# Altium schematic sheet CAN&IR.SchDoc
size A4; Revision: B.2
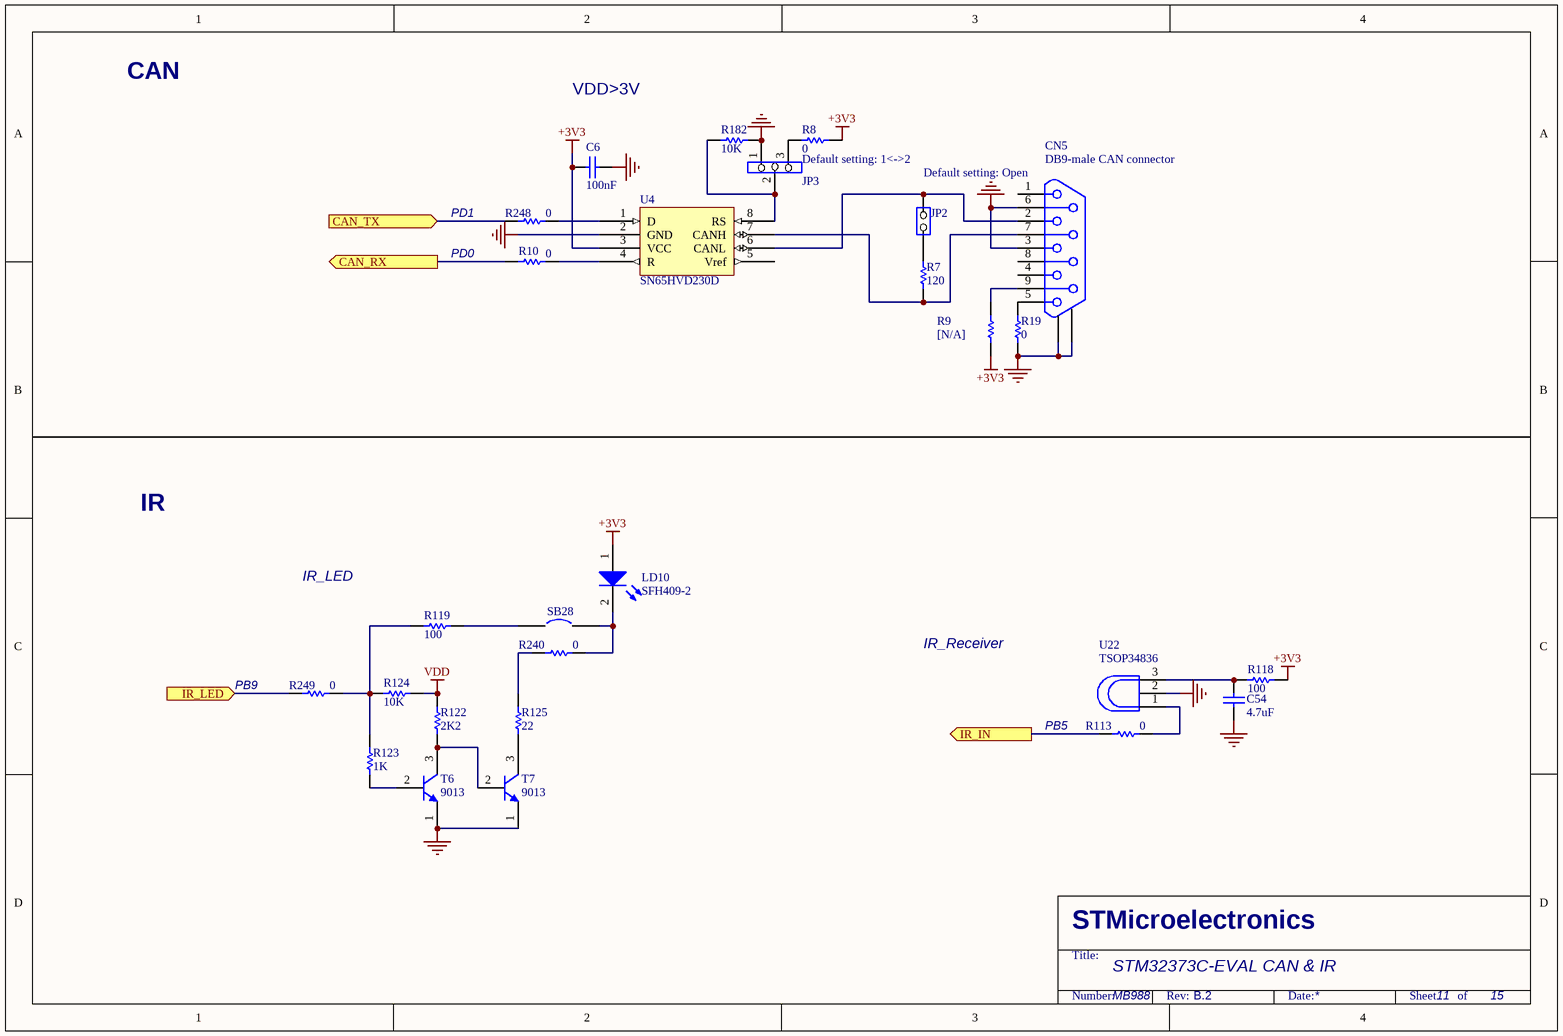
[diagram p0: CAN&IR.SchDoc]

## Parts
C6  100nF  [0603C]
C54  4.7uF  [0603C]
CN5  DB9-male CAN connector  [DB9/M]
JP2  (no value)  [SIP2]
JP3  (no value)  [SIP3]
LD10  SFH409-2  [D0.1L]
R7  120  [0603R]
R8  0  [0603R]
R9  [N/A]  [0603R]
R10  0  [0603R]
R19  0  [0603R]
R113  0  [0603R]
R118  100  [0603R]
R119  100  [0603R]
R122  2K2  [0603R]
R123  1K  [0603R]
R124  10K  [0603R]
R125  22  [0603R]
R182  10K  [0603R]
R240  0  [0603R]
R248  0  [0603R]
R249  0  [0603R]
SB28  (no value)  [JP2_SMD]
T6  9013  [SOT-23]
T7  9013  [SOT-23]
U4  SN65HVD230D  [SO8]
U22  TSOP34836  [TSOP348]

## Ports
CAN_RX (out), CAN_TX (in), IR_IN (out), IR_LED (in)

## Nets
+3V3: C6.2 LD10.1(A) R8.2 R9.1 R118.2 U4.3(VCC)
GND: C6.1 C54.2 CN5.0 CN5.3 CN5.6 JP3.1 R19.1 R182.2 T6.1(E) T7.1(E) U4.2(GND) U22.2(GND)
VDD: R122.2 R124.1
CAN_RX: R10.1 ; port CAN_RX
CAN_TX: R248.2 ; port CAN_TX
IR_IN: R113.1 ; port IR_IN
IR_LED: R249.2 ; port IR_LED
NetC54_1: C54.1 R118.1 U22.3(Vs)
NetCN5_2: CN5.2 JP2.2(NO) U4.6(CANL)
NetCN5_5: CN5.5 R19.2
NetCN5_7: CN5.7 R7.1 U4.7(CANH)
NetCN5_9: CN5.9 R9.2
NetJP2_1: JP2.1(COMMON) R7.2
NetJP3_2: JP3.2 R182.1 U4.8(RS)
NetJP3_3: JP3.3 R8.1
NetLD10_2: LD10.2(K) R240.2 SB28.2
NetR10_2: R10.2 U4.4(R)
NetR113_2: R113.2 U22.1(OUT)
NetR119_1: R119.1 SB28.1
NetR119_2: R119.2 R123.1 R124.2 R249.1
NetR122_1: R122.1 T6.3(C) T7.2(B)
NetR123_2: R123.2 T6.2(B)
NetR125_1: R125.1 T7.3(C)
NetR125_2: R125.2 R240.1
NetR248_1: R248.1 U4.1(D)

Not connected (* = marked no-connect by the designer): CN5 1 4 8; U4 5(Vref)

## Notes on the sheet
- CAN
- VDD>3V
- Default setting: 1<->2
- (near CN5) Default setting: Open
- PD1
- PD0
- IR
- IR_LED
- IR_Receiver
- (near R249) PB9
- PB5
- STM32373C-EVAL CAN & IR
- MB988
- 11
- 15
- STMicroelectronics
- Title:
- Number:
- Rev:
- Date:
- Sheet       of

## Library data of the parts
C6 = CAP: Capacitor; Published: 8-Jun-2000; Revision: July-2002: Re-released for DXP Platform.; Publisher: Altium Limited; Value: 100nF
C54 = Cap: Capacitor; Value: 10nF; Published: 8-Jun-2000; Revision: July-2002: Re-released for DXP Platform.; Publisher: Altium Limited
CN5 = DB9
JP2 = JP2
JP3 = Jumper3
LD10 = LED2: Typical RED, GREEN, YELLOW, AMBER GaAs LED; Published: 8-Jun-2000; Revision: July-2002: Re-released for DXP Platform.; Publisher: Altium Limited
R7-R9 R19 R182 = res1: Resistor; Value: 1K; Published: 8-Jun-2000; Revision: July-2002: Re-released for DXP Platform.; Publisher: Altium Limited
R10 R113 R118 R119 R122 R124 R125 R240 R248 R249 = Res1: Resistor; Value: 1K; Published: 8-Jun-2000; Revision: July-2002: Re-released for DXP Platform.; Publisher: Altium Limited
R123 = Res1: Resistor; Published: 8-Jun-2000; Revision: July-2002: Re-released for DXP Platform.; Publisher: Altium Limited; Value: 1K
SB28 = Circuit Breaker: Published: 24-Mar-1999; Revision: July-2002: Re-released for DXP Platform.; Publisher: Altium Limited
T6 T7 = NPN: NPN Bipolar Transistor; Code - JEDEC: TO-226-AA; Published: 8-Jun-2000; Revision: July-2002: Re-released for DXP Platform.; Publisher: Altium Limited
U22 = TSOP34838